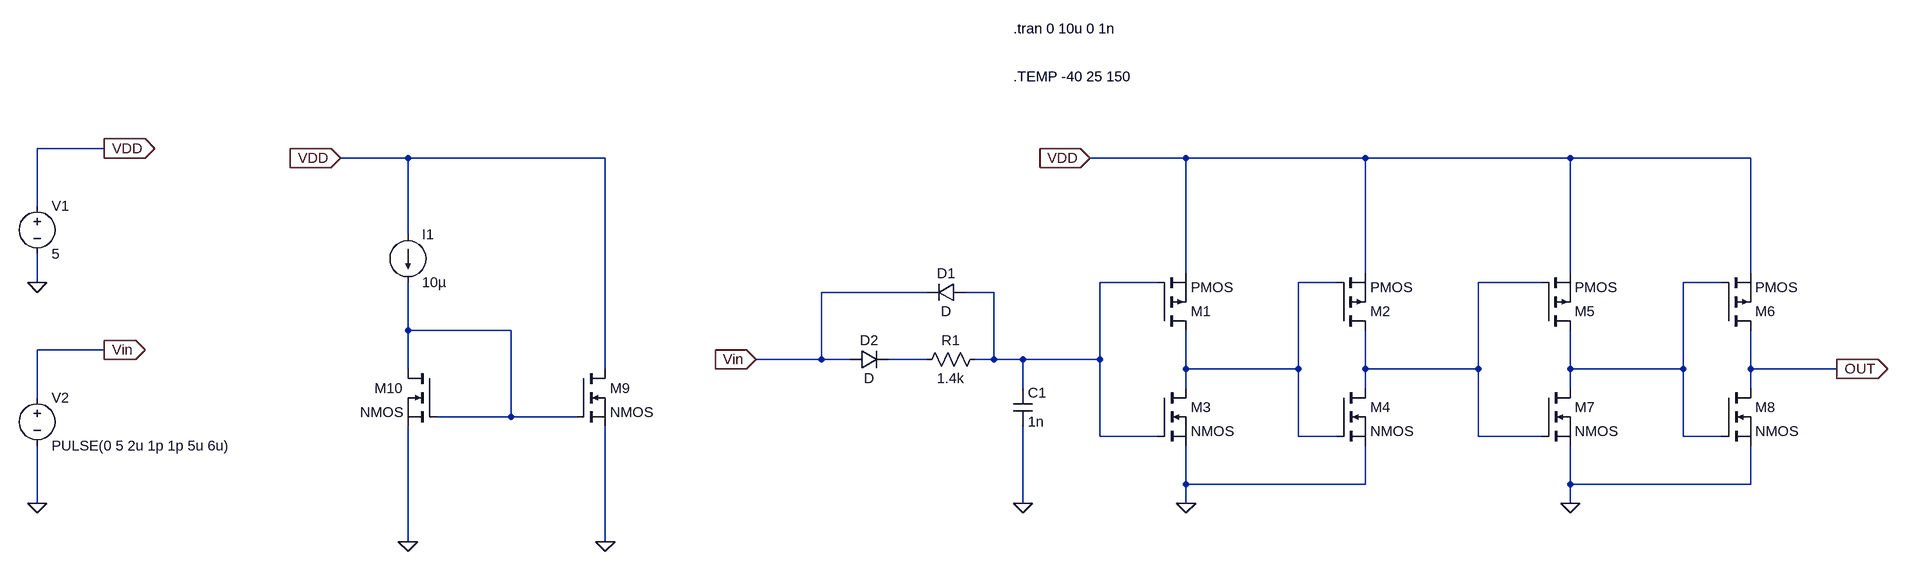
[diagram p0: schematic Report5_old.asc]
Report5_old.asc, the LTspice schematic file:
Version 4
SHEET 1 1612 680
WIRE -2016 -80 -2128 -80
WIRE -1360 -64 -1472 -64
WIRE -976 -64 -1360 -64
WIRE 144 -64 -16 -64
WIRE 528 -64 144 -64
WIRE 976 -64 528 -64
WIRE 1360 -64 976 -64
WIRE -2128 16 -2128 -80
WIRE -1360 64 -1360 -64
WIRE 144 128 144 -64
WIRE 528 128 528 -64
WIRE 976 128 976 -64
WIRE 1360 128 1360 -64
WIRE -2128 144 -2128 96
WIRE 96 144 0 144
WIRE 480 144 416 144
WIRE 928 144 816 144
WIRE 1312 144 1248 144
WIRE -288 160 -464 160
WIRE -176 160 -224 160
WIRE -1360 224 -1360 144
WIRE -1168 224 -1360 224
WIRE -2016 256 -2128 256
WIRE -464 272 -464 160
WIRE -464 272 -576 272
WIRE -416 272 -464 272
WIRE -288 272 -352 272
WIRE -176 272 -176 160
WIRE -176 272 -208 272
WIRE -128 272 -176 272
WIRE 0 272 0 144
WIRE 0 272 -128 272
WIRE -1360 288 -1360 224
WIRE -976 288 -976 -64
WIRE 144 288 144 224
WIRE 416 288 416 144
WIRE 416 288 144 288
WIRE 528 288 528 224
WIRE 816 288 816 144
WIRE 816 288 528 288
WIRE 976 288 976 224
WIRE 1248 288 1248 144
WIRE 1248 288 976 288
WIRE 1360 288 1360 224
WIRE 1504 288 1360 288
WIRE -128 320 -128 272
WIRE 144 320 144 288
WIRE 528 320 528 288
WIRE 976 320 976 288
WIRE 1360 320 1360 288
WIRE -2128 336 -2128 256
WIRE -1168 368 -1168 224
WIRE -1168 368 -1312 368
WIRE -1024 368 -1168 368
WIRE 0 400 0 272
WIRE 96 400 0 400
WIRE 416 400 416 288
WIRE 480 400 416 400
WIRE 816 400 816 288
WIRE 928 400 816 400
WIRE 1248 400 1248 288
WIRE 1312 400 1248 400
WIRE 144 480 144 416
WIRE 528 480 528 416
WIRE 528 480 144 480
WIRE 976 480 976 416
WIRE 1360 480 1360 416
WIRE 1360 480 976 480
WIRE -2128 512 -2128 416
WIRE -128 512 -128 384
WIRE 144 512 144 480
WIRE 976 512 976 480
WIRE -1360 576 -1360 384
WIRE -976 576 -976 384
FLAG -16 -64 VDD
IOPIN -16 -64 In
FLAG -576 272 Vin
IOPIN -576 272 In
FLAG -128 512 0
FLAG 144 512 0
FLAG -2128 144 0
FLAG -2128 512 0
FLAG -2016 -80 VDD
IOPIN -2016 -80 Out
FLAG -2016 256 Vin
IOPIN -2016 256 Out
FLAG 1504 288 OUT
IOPIN 1504 288 Out
FLAG 976 512 0
FLAG -1360 576 0
FLAG -976 576 0
FLAG -1472 -64 VDD
IOPIN -1472 -64 In
SYMBOL pmos 96 224 M180
SYMATTR InstName M1
SYMBOL pmos 480 224 M180
SYMATTR InstName M2
SYMBOL nmos 96 320 R0
SYMATTR InstName M3
SYMBOL nmos 480 320 R0
SYMATTR InstName M4
SYMBOL res -192 256 R90
WINDOW 0 0 56 VBottom 2
WINDOW 3 32 56 VTop 2
SYMATTR InstName R1
SYMATTR Value 1.4k
SYMBOL cap -144 320 R0
SYMATTR InstName C1
SYMATTR Value 1n
SYMBOL voltage -2128 0 R0
WINDOW 123 0 0 Left 0
WINDOW 39 0 0 Left 0
SYMATTR InstName V1
SYMATTR Value 5
SYMBOL voltage -2128 320 R0
WINDOW 123 0 0 Left 0
WINDOW 39 0 0 Left 0
SYMATTR InstName V2
SYMATTR Value PULSE(0 5 2u 1p 1p 5u 6u)
SYMBOL diode -224 144 R90
WINDOW 0 0 32 VBottom 2
WINDOW 3 32 32 VTop 2
SYMATTR InstName D1
SYMBOL diode -416 288 R270
WINDOW 0 32 32 VTop 2
WINDOW 3 0 32 VBottom 2
SYMATTR InstName D2
SYMBOL pmos 928 224 M180
SYMATTR InstName M5
SYMBOL pmos 1312 224 M180
SYMATTR InstName M6
SYMBOL nmos 928 320 R0
SYMATTR InstName M7
SYMBOL nmos 1312 320 R0
SYMATTR InstName M8
SYMBOL nmos -1024 288 R0
SYMATTR InstName M9
SYMBOL nmos -1312 288 M0
SYMATTR InstName M10
SYMBOL current -1360 64 R0
WINDOW 123 0 0 Left 0
WINDOW 39 0 0 Left 0
SYMATTR InstName I1
SYMATTR Value 10µ
TEXT -144 -280 Left 2 !.tran 0 10u 0 1n
TEXT -144 -200 Left 2 !.TEMP -40 25 150

The netlist it stands for:
* Report5_old.asc
M1 N002 N001 VDD VDD PMOS
M2 N003 N002 VDD VDD PMOS
M3 N002 N001 0 0 NMOS
M4 N003 N002 0 0 NMOS
R1 N001 N006 1.4k
C1 N001 0 1n
V1 VDD 0 5
V2 Vin 0 PULSE(0 5 2u 1p 1p 5u 6u)
D1 N001 Vin D
D2 Vin N006 D
M5 N004 N003 VDD VDD PMOS
M6 OUT N004 VDD VDD PMOS
M7 N004 N003 0 0 NMOS
M8 OUT N004 0 0 NMOS
M9 VDD N005 0 0 NMOS
M10 N005 N005 0 0 NMOS
I1 VDD N005 10µ
.model D D
.lib standard.dio
.model NMOS NMOS
.model PMOS PMOS
.lib standard.mos
.tran 0 10u 0 1n
.TEMP -40 25 150
.backanno
.end